# Altium schematic sheet Sheet1.SchDoc
size A4
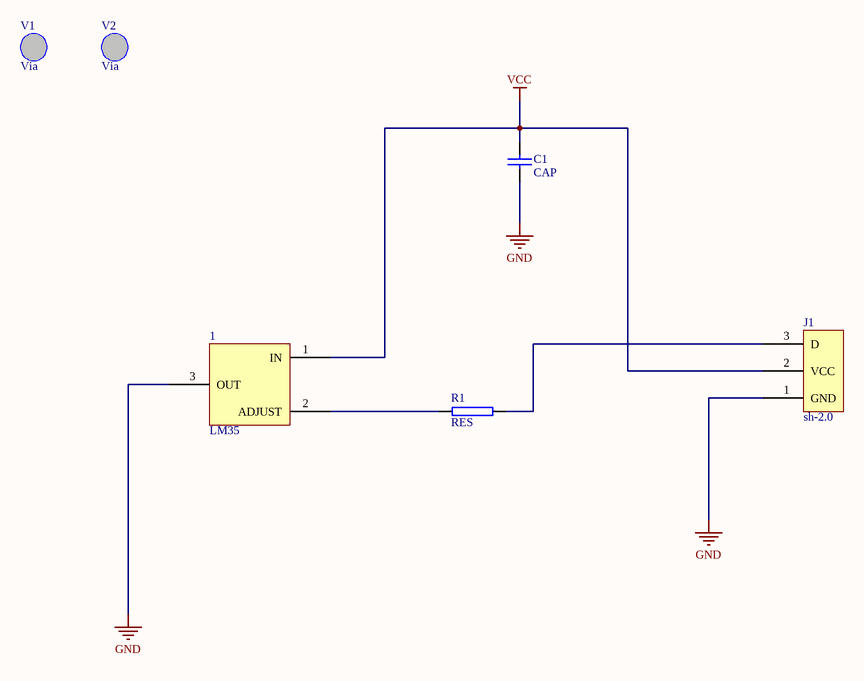
[diagram p0: Sheet1.SchDoc]

## Parts
1  LM35  [TO-92]
C1  CAP  [1608[0603]]
J1  sh-2.0  [sh-2.0]
R1  RES  [1608[0603]]
V1  Via  [Via]
V2  Via  [Via]

## Nets
GND: 1.3(OUT) C1.2 J1.1(GND)
VCC: 1.1(IN) C1.1 J1.2(VCC)
Net1_2: 1.2(ADJUST) R1.2
NetJ1_3: J1.3(D) R1.1

## Library data of the parts
1 = LM317: pin to pad: 1>3 3>1
J1 = sh-2.0: pin to pad: 1>3 3>1